# Altium schematic sheet regulation.SchDoc
size A4; SheetNumber: 3
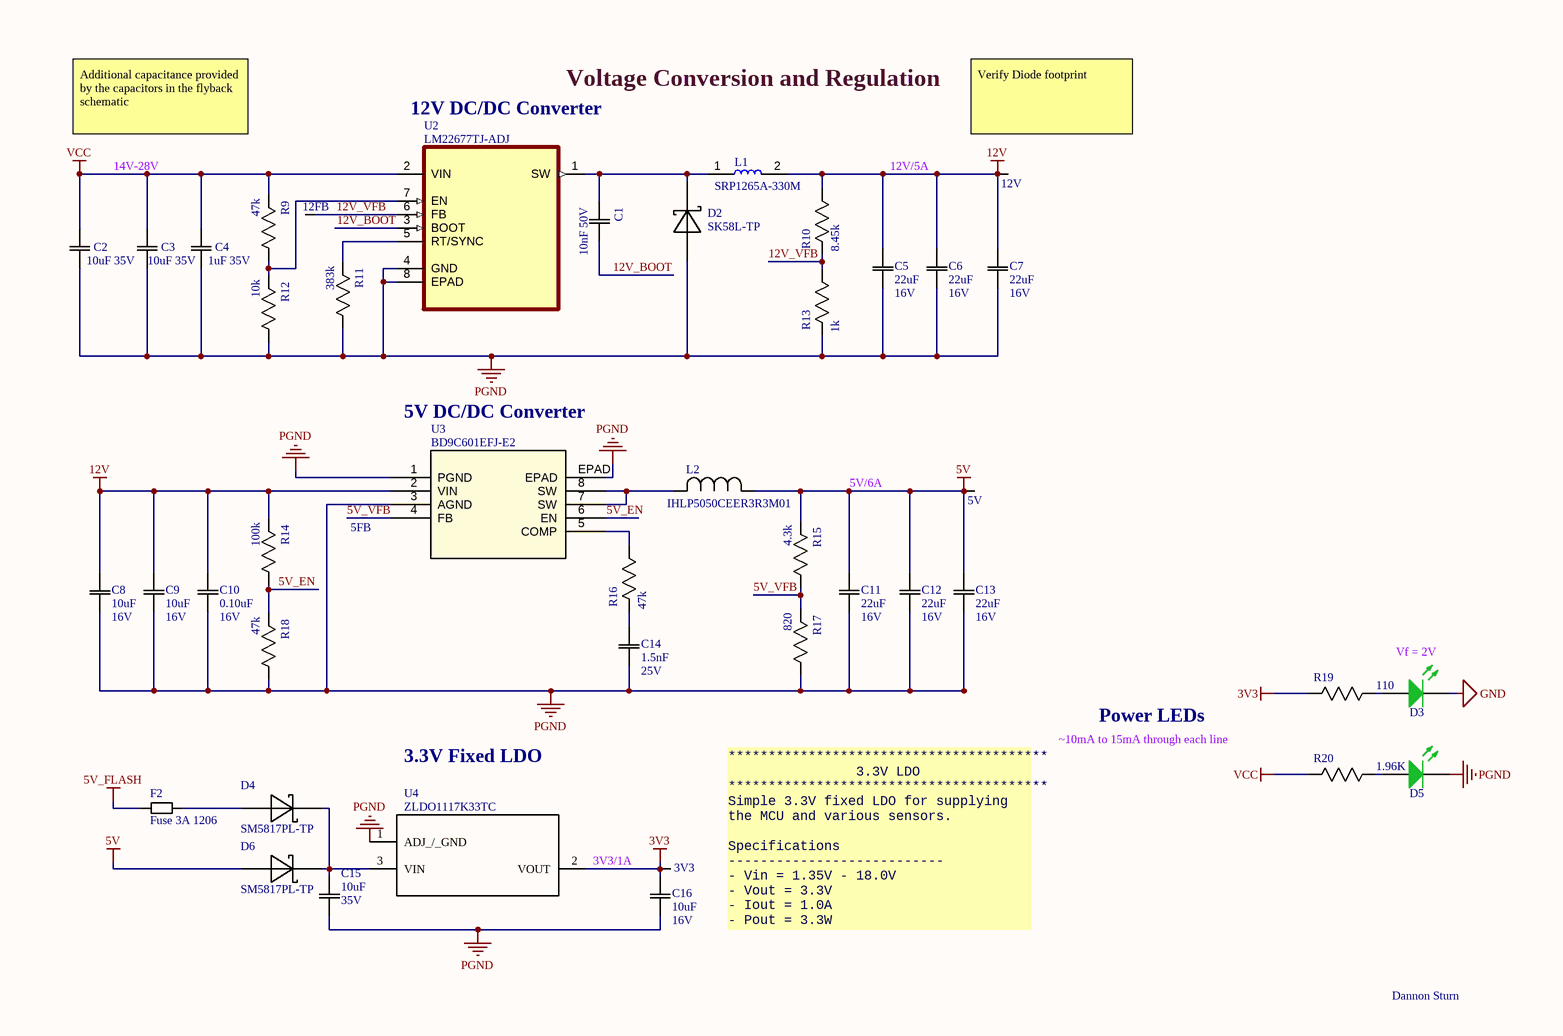
[diagram p0: regulation.SchDoc]

## Parts
3V3  Test Point (Via)  [TP]  (value not drawn)
5FB  Test Point (Via)  [TP]  (value not drawn)
5V  Test Point (Via)  [TP]  (value not drawn)
12FB  Test Point (Via)  [TP]  (value not drawn)
12V  Test Point (Via)  [TP]  (value not drawn)
C1  10nF 50V  [0603]
C2  10uF 35V  [0805]
C3  10uF 35V  [0805]
C4  1uF 35V  [0805]
C5  Rating: 16V  [0805]  (hidden comment: 22uF)
C6  Rating: 16V  [0805]  (hidden comment: 22uF)
C7  Rating: 16V  [0805]  (hidden comment: 22uF)
C8  Rating: 16V  [0603]  (hidden comment: 10uF)
C9  Rating: 16V  [0603]  (hidden comment: 10uF)
C10  Rating: 16V  [0603]  (hidden comment: 0.10uF)
C11  Rating: 16V  [0805]  (hidden comment: 22uF)
C12  Rating: 16V  [0805]  (hidden comment: 22uF)
C13  Rating: 16V  [0805]  (hidden comment: 22uF)
C14  Rating: 25V  [0603]  (hidden comment: 1.5nF)
C15  value 10uF  Rating: 35V  [0805]  (hidden comment: 10uF 35V)
C16  Rating: 16V  [0603]  (hidden comment: 10uF)
D2  SK58L-TP  [DIOSC6959X240]
D3  LED2  [3.2X1.6X1.1]  (value not drawn)
D4  SM5817PL-TP  [SOD-123]
D5  LED2  [3.2X1.6X1.1]  (value not drawn)
D6  SM5817PL-TP  [SOD-123]
F2  Fuse 3A 1206  [1206]
L1  SRP1265A-330M  [IND_SRP1265A-330M]
L2  IHLP5050CEER3R3M01  [IND_IHLP-5050CE_VIS]
R9  47k  [0603]
R10  8.45k  [0603]
R11  383k  [0603]
R12  10k  [0603]
R13  1k  [0603]
R14  100k  [0603]
R15  4.3k  [0603]
R16  47k  [0603]
R17  820  [0603]
R18  47k  [0603]
R19  110  [0603]
R20  1.96K  [0603]
U2  LM22677TJ-ADJ  [TO127P1435X210-8N]
U3  BD9C601EFJ-E2  [HTSOP-J8_ROM-BD9C601EFJ-E2]
U4  ZLDO1117K33TC  [DPAK (TO-252)]

## Nets
3V3: 3V3.1 C16.2(C2) R19.2(R2) U4.2(VOUT)
5V: 5V.1 C11.1(C1) C12.1(C1) C13.1(C1) D6.A L2.1 R15.2(R2)
5V_FLASH: F2.1
12V: 12V.1 C5.2(C2) C6.2(C2) C7.2(C2) C8.2(C2) C9.1(C1) C10.1(C1) L1.2 R10.1(R1) R14.2(R2) U3.2(VIN)
GND: D3.2(K)
PGND: C2.2(C2) C3.2(C2) C4.2(C2) C5.1(C1) C6.1(C1) C7.1(C1) C8.1(C1) C9.2(C2) C10.2(C2) C11.2(C2) C12.2(C2) C13.2(C2) C14.1(C1) C15.2(C2) C16.1(C1) D2.A D5.2(K) R11.1(R1) R12.1(R1) R13.2(R2) R17.1(R1) R18.1(R1) U2.4(GND) U2.8(EPAD) U3.1(PGND) U3.3(AGND) U3.EPAD U4.1(ADJ_/_GND)
VCC: C2.1(C1) C3.1(C1) C4.1(C1) R9.2(R2) R20.2(R2) U2.2(VIN)
5V_EN: R14.1(R1) R18.2(R2) U3.6(EN)
5V_VFB: 5FB.1 R15.1(R1) R17.2(R2) U3.4(FB)
12V_BOOT: C1.2(C2) U2.3(BOOT)
12V_VFB: 12FB.1 R10.2(R2) R13.1(R1) U2.6(FB)
NetC1_1: C1.1(C1) D2.C(K) L1.1 U2.1(SW)
NetC14_2: C14.2(C2) R16.2(R2)
NetC15_1: C15.1(C1) D4.C(K) D6.C(K) U4.3(VIN)
NetD3_1: D3.1(A) R19.1(R1)
NetD4_A: D4.A F2.2
NetD5_1: D5.1(A) R20.1(R1)
NetL2_2: L2.2 U3.7(SW) U3.8(SW)
NetR9_1: R9.1(R1) R12.2(R2) U2.7(EN)
NetR11_2: R11.2(R2) U2.5(RT/SYNC)
NetR16_1: R16.1(R1) U3.5(COMP)

## Notes on the sheet
- 12V DC/DC Converter
- Voltage Conversion and Regulation
- Additional capacitance provided by the capacitors in the flyback schematic
- 14V-28V
- 12V/5A
- (near 12V) Verify Diode footprint
- 5V DC/DC Converter
- 5V/6A
- Vf = 2V
- 3.3V Fixed LDO
- ~10mA to 15mA through each line
- Power LEDs
- 3V3/1A
- ****************************************
  3.3V LDO
  ****************************************
  Simple 3.3V fixed LDO for supplying the MCU and various sensors.
  Specifications
  ---------------------------
  - Vin = 1.35V - 18.0V
  - Vout = 3.3V
  - Iout = 1.0A
  - Pout = 3.3W
- Dannon Sturn
- DWG NO:
- REV:
- THIS DOCUMENT AND THE DATA DISCLOSED HEREIN OR
- HEREWITH IS THE PROPERTY OF ALTIUM LIMITED AND MAY
- BE FREELY DISTRIBUTED IN WHOLE. NO RIGHTS ARE
- RESERVED OR EXPRESS OR IMPLIED WARANTEE GIVEN.
- REVISION
- DESCRIPTION
- DATE
- APPROVED
- ENG:
- APPROVALS
- PROJECT
- DSN:
- CHK:
- REFERENCE DOCUMENTS
- PROJECT REVISION:
- TITLE
- DOCUMENT REVISION:
- DESIGN ITEM:
- BOM:
- FAB DWG:
- PCB DWG:
- ASSY DWG:
- SCALE:
- A2
- SIZE
- CAGE CODE
- FILE NAME
- DWG NO.
- SHEET
- OF
- REV

## Library data of the parts
C1 = CAP 10nF 50V: CAP CER 10000PF 50V X7R 0805; Tolerance: 10%; Package: 0805; Value: 10nF; Rating: 50V; Temperature Coefficient: X7R; Operating Temperature: -55°C ~ 125°C
C2 C3 C15 = CAP 10uF 35V: CAP CER 10uF 35V X5R 1206/0805; Tolerance: 10%; Package: 1206; Temperature Coefficient: X5R; Operating Temperature: -55°C ~ 85°C
  C2 C3: Value: 10uF; Rating: 35V
C4 = CAP 1uF 35V: CAP CER 1UF 35V X7R 0805; Tolerance: 10%; Package: 0805; Value: 1uF; Rating: 35V; Temperature Coefficient: X7R; Operating Temperature: -55°C ~ 125°C
C5-C7 C11-C13 = CAP 22uF 16V: CAP CER 22UF 16V X5R 0805; Tolerance: 10%; Package: 0805; Temperature Coefficient: X5R; Operating Temperature: -55°C ~ 85°C; Value: 22uF
C8 C9 C16 = CAP 10uF 16V: CAP CER 10UF 16V X5R 0603/0805; Tolerance: 10%; Package: 0603/0805; Temperature Coefficient: X5R; Operating Temperature: -55°C ~ 85°C; Value: 10uF
C10 = CAP 0.10uF 16V: CAP CER 0.10UF 16V X5R 0603/0805; Tolerance: 10%; Package: 0603/0805; Temperature Coefficient: X5R; Operating Temperature: -55°C ~ 85°C; Value: 0.10uF
C14 = CAP 1500pF 25V: CAP CER 1500pF 25V X7R 0603; Tolerance: 1%; Package: 0603; Temperature Coefficient: X7R; Operating Temperature: -55C - +125C; Value: 1.5nF
D2 = DIODE SCHOTTKY 80V 5A: Diode Schottky 80V 5A Surface Mount SMA; Voltage - Forward (Vf) (Max) @ If: 850 mV @ 5 A; Voltage - DC Reverse (Vr) (Max): 80V; Package: DO-214AB; Current - Average Rectified (Io): 5A; Supplier 1: Digi-Key; Supplier Part Number 1: SK58L-TPMSCT-ND
D3 D5 = LED GREEN SMD: Typical RED, GREEN, YELLOW, AMBER GaAs LED; Voltage - Forward (Vf) (Typ): 2V; Lens Transparency: Clear; Current - Test: 20mA; Package: 1206; Color: Green
D4 D6 = DIODE SCHOTTKY 20V 1A: Diode Schottky 20V 1A Surface Mount SOD-123FL; MF: Micro Commercial Co; ComponentLink1Description: digikey; ComponentLink1URL: https://www.digikey.ca/product-detail/en/on-semiconductor/MBR0540T1G/MBR0540T1GOSCT-ND/917967; Digikey: SM5817PL-TPMSCT-ND; Digikey Link: https://www.digikey.ca/product-detail/en/micro-commercial-co/SM5817PL-TP/SM5817PL-TPMSCT-ND/1793410; MP: SM5817PL-TP; Voltage Rating: 20V; Package: SOD-123; Current Rating: 1A; Supplier 1: Digi-Key; Supplier 2: Arrow Electronics; Supplier 3: Future Electronics; Supplier 4: Mouser
F2 = FUSE 3A 63V SLOW: FUSE 3A 63V AC/DC SLOW 1206; Response Time: Slow Blow; Current Rating (Amps): 3A; Operating Temperature: -55°C ~ 90°C; Voltage Rating - AC: 63V; Voltage Rating - DC: 63V
L1 = IND 33UH 8A 58 MOHM SMD: 33µH Shielded Wirewound Inductor 8A 58mOhm Max Nonstandard; MF: Bourns; SnapEDA_Link: https://www.snapeda.com/parts/SRP1265A-330M/Bourns/view-part/55645/?ref=snap; Availability: Unavailable; Value: *; Package: 1008 Bourns; MP: SRP1265A-330M; Price: None; Supplier 1: Digi-Key; Supplier 2: Newark; Supplier 3: Mouser
L2 = IND 3.3UH 12A 12 MOHM SMD: 3.3uH 12A Shielded Molded Inductor 12mOhm Max; Mfr_Name: Vishay; Type: DEV; Copyright: Copyright (C) 2021 Ultra Librarian. All rights reserved.; Manufacturer_Part_Number: IHLP5050CEER3R3M01; Digi-Key_Part_Number_1: 541-1020-1-ND; Digi-Key_Part_Number_2: 541-1020-2-ND; Digi-Key_Part_Number_3: 541-1020-6-ND; RefDes: RefDes; Supplier 1: Digi-Key; Supplier Part Number 1: 541-1020-1-ND
R9 R18 = RES 47k 1/8W - 5%: RES SMD 47k OHM 5% 1/8W 0805; Power (Watts): 0.125W; Package: 0805; Value: 47k; Tolerance: 5%
R10 = RES 8.45k 1/8W: RES SMD 8.45k OHM 1% 1/8W 0603; Power (Watts): 0.125W; Package: 0603; Value: 8.45k; Tolerance: 1%
R11 = RES 383k 1/10W: RES SMD 383k OHM 1% 1/10W 0603; Power (Watts): 0.1W; Package: 0603; Value: 383k; Tolerance: 1%
R12 = RES 10k 1/8W - 5%: RES SMD 10K OHM 5% 1/8W 0805/0603; Power (Watts): 0.125W; Package: 0805; Value: 10k; Tolerance: 5%
R13 = RES 1k 1/8W - 1%: RES SMD 1K OHM 1% 1/8W 0603/0805; Power (Watts): 0.125W; Package: 0805; Value: 1k; Tolerance: 1%
R14 = RES 100k 1/8W - 5%: RES SMD 100K OHM 5% 1/8W 0805/0603; Power (Watts): 0.125W; Package: 0805; Value: 100k; Tolerance: 5%
R15 = RES 4.3k 1/10W: RES SMD 4.3K OHM 1% 1/10W 0603; Power (Watts): 0.1W; Tolerance: 5%; Package: 0603; Value: 4.3k
R16 = RES 47k 1/8W - 1%: RES SMD 47K OHM 1% 1/8W 0805; Power (Watts): 0.125W; Package: 0805; Value: 47k; Tolerance: 1%
R17 = RES 820 1/10W: RES SMD 820 OHM 1% 1/10W 0603; Power (Watts): 0.1W; Package: 0603; Value: 820; Tolerance: 1%
R19 = RES 110.0 1/8W - 1%: RES SMD 110 OHM 1% 1/8W 0805/0603; Power (Watts): 0.125W; Package: 0805; Value: 110; Tolerance: 1%
R20 = RES 1.96k 1/8W: RES SMD 1.96K OHM 1% 1/8W 0805; Power (Watts): 0.125W; Package: 0805; Value: 1.96k; Tolerance: 1%
U2 = LM22677TJ-ADJ: 3A SIMPLE SWITCHERÂ®, Step-Down Voltage Regulator; Package: None; Price: None; Value: *; MP: LM22677TJ-ADJ; Availability: Unavailable; ComponentLink1Description: octopart; ComponentLink1URL: https://octopart.com/search?q=LM22677TJ-ADJ%2FNOPB&currency=USD&specs=0
U3 = BD9C601EFJ-E2: IC REG BUCK ADJ 6A 8HTSOP-J; Mfr_Name: ROHM Semiconductor; Copyright: Copyright (C) 2021 Ultra Librarian. All rights reserved.; Manufacturer_Part_Number: BD9C601EFJ-E2; Digi-Key_Part_Number_1: 846-1115-2-ND; Digi-Key_Part_Number_2: 846-1115-1-ND; Digi-Key_Part_Number_3: 846-1115-6-ND; RefDes: RefDes; Type: DEV; Supplier 1: Digi-Key; Supplier 2: Newark; Supplier 3: Avnet; Supplier 4: Farnell; Supplier Part Number 1: 846-1115-1-ND; Supplier Part Number 2: 53X2986; Supplier Part Number 3: BD9C601EFJ-E2; Supplier Part Number 4: 2420849
U4 = ZLDO1117K33TC: Linear Voltage Regulator IC Positive Fixed 1 Output  1A TO-252-3; MF: Diodes Incorporated; Package: TO-252-3; MP: ZLDO1117K33TC; Digikey: ZLDO1117K33DIDKR-ND; Digikey Link: https://www.digikey.ca/product-detail/en/diodes-incorporated/ZLDO1117K33TC/ZLDO1117K33DIDKR-ND/2095639; Supplier 1: Digi-Key; Supplier Part Number 1: ZLDO1117K33DICT-ND